# EAGLE design msp432_breakout_i2c (EAGLE 7.5.0)
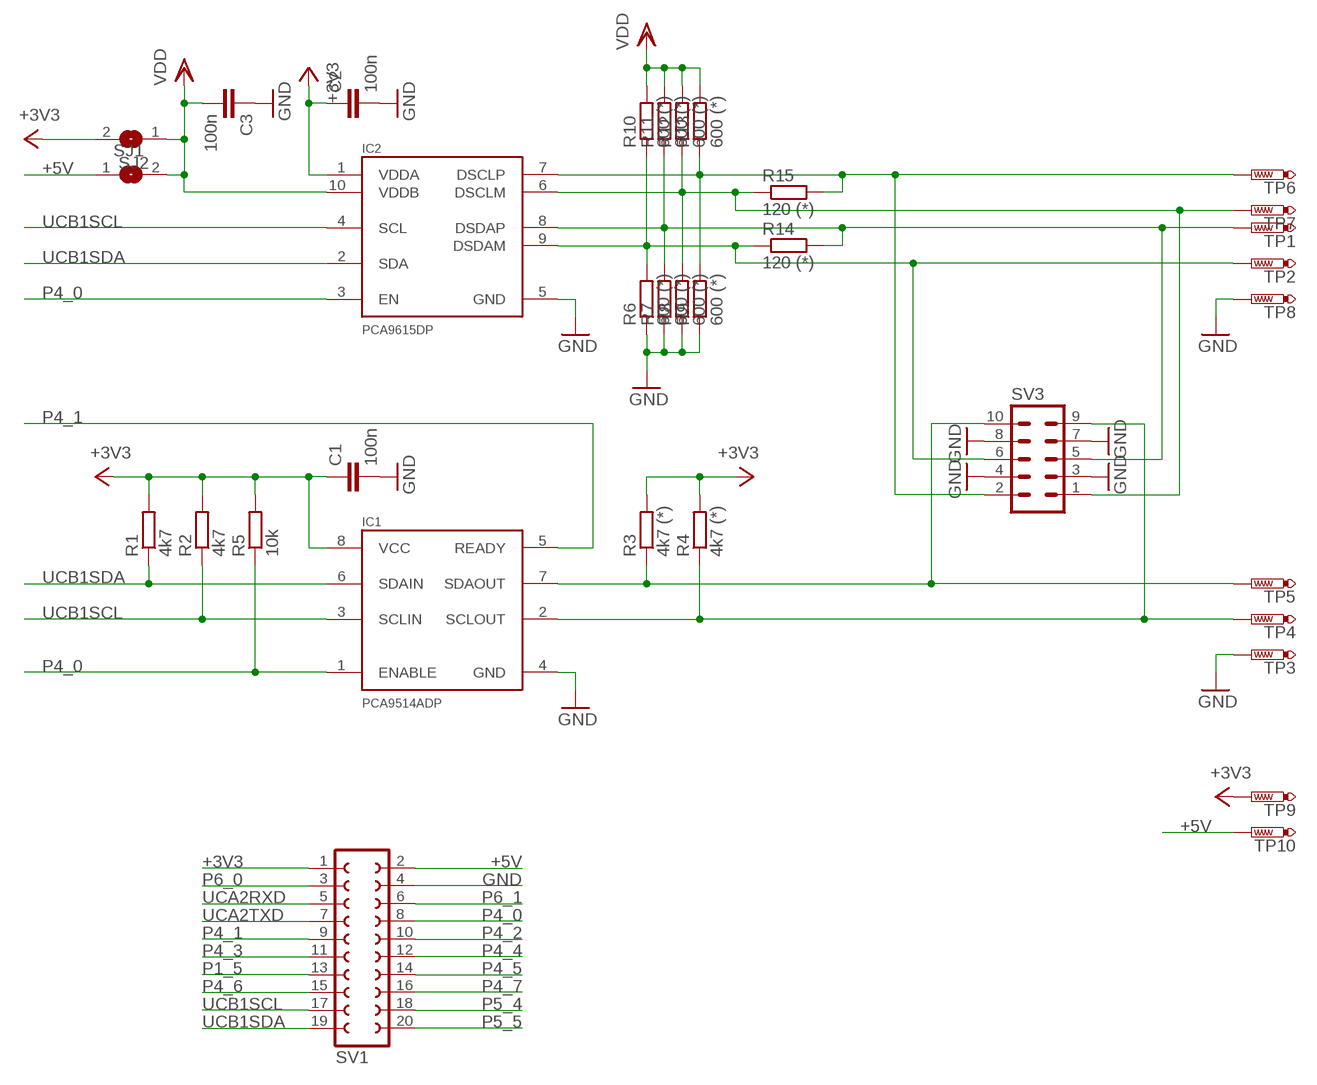
[diagram p0: schematic, sheet 1]

## Parts
C1  100n  C-EUC0603  [C0603]
C2  100n  C-EUC0603  [C0603]
C3  100n  C-EUC0603  [C0603]
IC1  PCA9514ADP  [TSSOP8]
IC2  PCA9615DP  [TSSOP10]
R1  4k7  R-EU_R0603  [R0603]
R2  4k7  R-EU_R0603  [R0603]
R3  4k7 (*)  R-EU_R0603  [R0603]
R4  4k7 (*)  R-EU_R0603  [R0603]
R5  10k  R-EU_R0603  [R0603]
R6  600 (*)  R-EU_R0603  [R0603]
R7  600 (*)  R-EU_R0603  [R0603]
R8  600 (*)  R-EU_R0603  [R0603]
R9  600 (*)  R-EU_R0603  [R0603]
R10  600 (*)  R-EU_R0603  [R0603]
R11  600 (*)  R-EU_R0603  [R0603]
R12  600 (*)  R-EU_R0603  [R0603]
R13  600 (*)  R-EU_R0603  [R0603]
R14  120 (*)  R-EU_R0603  [R0603]
R15  120 (*)  R-EU_R0603  [R0603]
SJ1  SJ  [SJ]
SJ2  SJ  [SJ]
SV1  FE10-2  [FE10-2]
SV3  ML10  [ML10]
TP1  DSDAP  PTR1PAD1-17  [P1-17]
TP2  DSDAM  PTR1PAD1-17  [P1-17]
TP3  GND  PTR1PAD1-17  [P1-17]
TP4  SCLOUT  PTR1PAD1-17  [P1-17]
TP5  SDAOUT  PTR1PAD1-17  [P1-17]
TP6  DSCLP  PTR1PAD1-17  [P1-17]
TP7  DSCLM  PTR1PAD1-17  [P1-17]
TP8  GND  PTR1PAD1-17  [P1-17]
TP9  3V3  PTR1PAD1-17  [P1-17]
TP10  5V  PTR1PAD1-17  [P1-17]

## Nets
+3V3: C1.1 C2.1 IC1.8(VCC) IC2.1(VDDA) R1.2 R2.2 R3.2 R4.2 R5.2 SJ2.2 SV1.1 TP9.TP
+5V: SJ1.1 SV1.2 TP10.TP
GND [power]: C1.2 C2.2 C3.1 IC1.4(GND) IC2.5(GND) R6.1 R7.1 R8.1 R9.1 SV1.4 SV3.3 SV3.4 SV3.7 SV3.8 TP3.TP TP8.TP
P1_5: SV1.13
P4_0: IC1.1(ENABLE) IC2.3(EN) R5.1 SV1.8
P4_1: IC1.5(READY) SV1.9
P4_2: SV1.10
P4_3: SV1.11
P4_4: SV1.12
P4_5: SV1.14
P4_6: SV1.15
P4_7: SV1.16
P5_4: SV1.18
P5_5: SV1.20
P6_0: SV1.3
P6_1: SV1.6
SCL: IC1.2(SCLOUT) R4.1 SV3.9 TP4.TP
SCLM: IC2.6(DSCLM) R8.2 R12.1 R15.1 SV3.1 TP7.TP
SCLP: IC2.7(DSCLP) R9.2 R13.1 R15.2 SV3.2 TP6.TP
SDA: IC1.7(SDAOUT) R3.1 SV3.10 TP5.TP
SDAM: IC2.9(DSDAM) R6.2 R10.1 R14.1 SV3.6 TP2.TP
SDAP: IC2.8(DSDAP) R7.2 R11.1 R14.2 SV3.5 TP1.TP
UCA2RXD: SV1.5
UCA2TXD: SV1.7
UCB1SCL: IC1.3(SCLIN) IC2.4(SCL) R2.1 SV1.17
UCB1SDA: IC1.6(SDAIN) IC2.2(SDA) R1.1 SV1.19
VDD: C3.2 IC2.10(VDDB) R10.2 R11.2 R12.2 R13.2 SJ1.2 SJ2.1

## Library data of the parts
C1-C3 = rcl:C-EU: CAPACITOR, European symbol
IC1 = sf-bluegiga:PCA9514A
IC2 = sf-bluegiga:PCA9615
R1-R15 = rcl:R-EU_: RESISTOR, European symbol
SJ1 SJ2 = jumper:SJ: SMD solder JUMPER
SV1 = con-lsta:FE10-2: FEMALE HEADER; OC_FARNELL: unknown; OC_NEWARK: unknown
SV3 = con-harting-ml:ML10: HARTING; OC_FARNELL: unknown; OC_NEWARK: unknown
TP1-TP10 = testpad:PTR1: TEST PIN

## Net classes
1 power: width 0.254 mm, drill 0.33 mm, clearance 0.152 mm

## Board
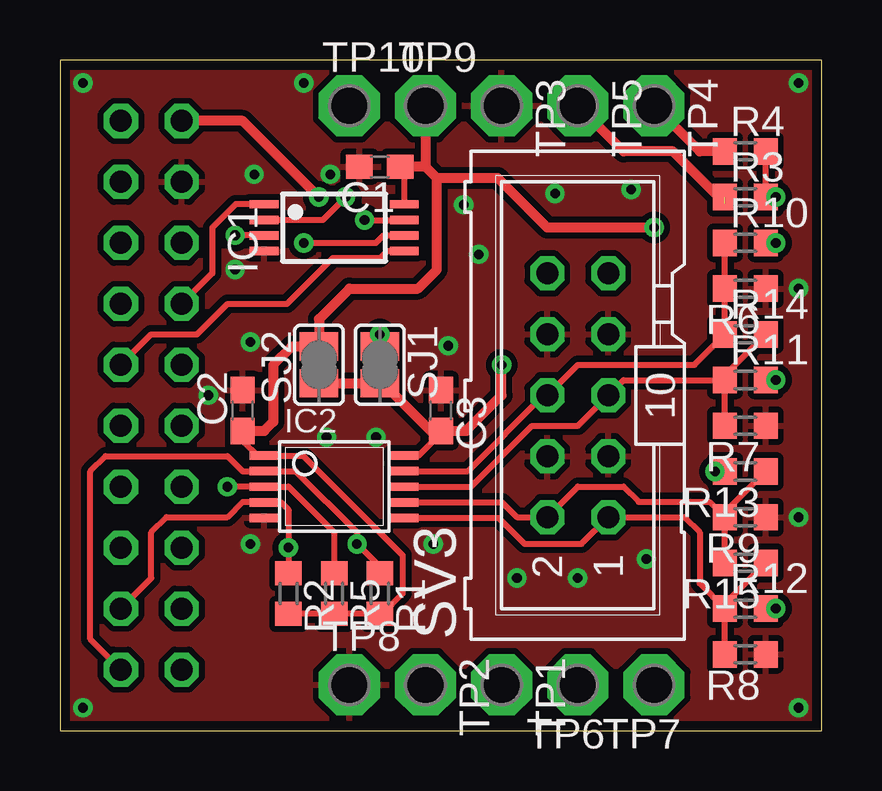
[diagram p1: board, top side]
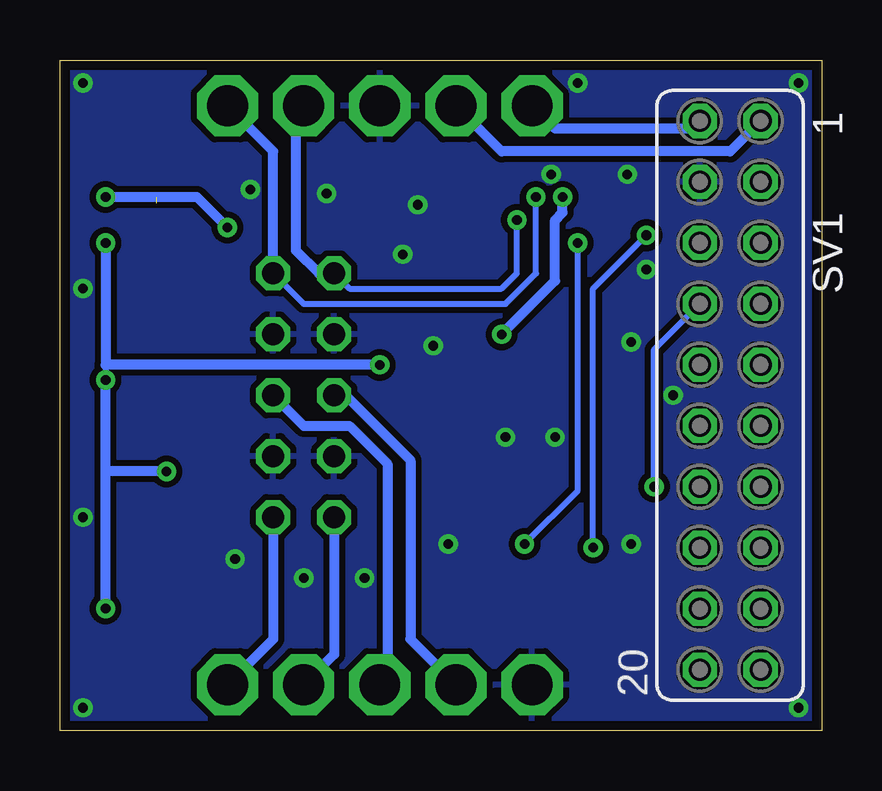
[diagram p2: board, bottom side, seen from below]

Size 31.75 x 27.94 mm. Coordinates in mm from the lower left corner, seen from the top.
Outline: 0,27.94 0,0 31.75,0 31.75,27.94 0,27.94
Copper layers (1*16): Top 0.035mm / dielectric 1.5mm / Bottom 0.035mm
Design rules "default *": minimum track width 10mil, minimum drill 0.4mm, track to track 8mil, track to pad 8mil, pad to pad 8mil, via to via 8mil, smd to smd 0mil, copper to edge 16mil, drill to drill 8mil, minimum pad ring 10mil, minimum via ring 8mil, stop-mask expansion 4mil, vias tented up to drill 0.4mm, thermal gap 10mil

### Footprints (pad centres in the part's own frame; a part is rotated, then mirrored left to right if it is on the bottom)
C0603 = smd 1.1 x 1: 1 -0.85,0; 2 0.85,0
TSSOP8 = smd 1.2 x 0.35: 1 -2.925,0.975; 2 -2.925,0.325; 3 -2.925,-0.325; 4 -2.925,-0.975; 5 2.925,-0.975; 6 2.925,-0.325; 7 2.925,0.325; 8 2.925,0.975
TSSOP10 = smd 0.35 x 1.2: 1 -1.3,-2.918; 2 -0.65,-2.918; 3 0,-2.918; 4 0.65,-2.918; 5 1.3,-2.918; 6 1.3,2.918; 7 0.65,2.918; 8 0,2.918; 9 -0.65,2.918; 10 -1.3,2.918
R0603 = smd 1 x 1.1: 1 -0.85,0; 2 0.85,0
SJ = smd 1.168 x 1.6: 1 -0.762,0; 2 0.762,0
FE10-2 = drill 0.914 octagon: 1 -11.43,1.27; 2 -11.43,-1.27; 3 -8.89,1.27; 4 -8.89,-1.27; 5 -6.35,1.27; 6 -6.35,-1.27; 7 -3.81,1.27; 8 -3.81,-1.27; 9 -1.27,1.27; 10 -1.27,-1.27; 11 1.27,1.27; 12 1.27,-1.27; 13 3.81,1.27; 14 3.81,-1.27; 15 6.35,1.27; 16 6.35,-1.27; 17 8.89,1.27; 18 8.89,-1.27; 19 11.43,1.27; 20 11.43,-1.27
ML10 = drill 0.914 octagon: 1 -5.08,-1.27; 2 -5.08,1.27; 3 -2.54,-1.27; 4 -2.54,1.27; 5 0,-1.27; 6 0,1.27; 7 2.54,-1.27; 8 2.54,1.27; 9 5.08,-1.27; 10 5.08,1.27
P1-17 = drill 1.702 pad 2.54 octagon: TP 0,0

### Placement (x,y rotation side)
C1  13.34,23.5 180 top
C2  7.62,13.34 90 top
C3  15.88,13.34 270 top
IC1  11.43,20.95 0 top
IC2  11.43,10.16 270 top
R1  13.34,5.71 270 top
R2  9.53,5.71 270 top
R3  28.57,22.23 0 top
R4  28.57,24.13 0 top
R5  11.43,5.71 270 top
R6  28.57,18.41 180 top
R7  28.57,12.7 180 top
R8  28.57,3.17 180 top
R9  28.57,8.89 180 top
R10  28.57,20.32 0 top
R11  28.57,14.61 0 top
R12  28.57,5.08 0 top
R13  28.57,10.79 180 top
R14  28.57,16.51 0 top
R15  28.57,6.99 180 top
SJ1  13.34,15.24 270 top
SJ2  10.79,15.24 90 top
SV1  3.81,13.97 270 bottom
SV3  21.59,13.97 90 top
TP1  18.41,1.91 270 top
TP2  15.24,1.91 270 top
TP3  18.41,26.04 270 top
TP4  24.77,26.04 270 top
TP5  21.59,26.04 270 top
TP6  21.59,1.91 180 top
TP7  24.77,1.91 180 top
TP8  12.06,1.91 0 top
TP9  15.24,26.04 0 top
TP10  12.06,26.04 0 top

### Tracks (layer width: path | path; a pad name or v marks a point on that pad's centre or on a via)
+3V3  (via drill 0.4)
  Top 0.254: R3.2 R4.2 | 8.29,11.46 8.26,11.43 | R2.2 R5.2 R1.2 13.44,4.87 14.29,5.71 14.29,7.3 10.13,11.46 IC2.1 8.48,11.43 8.26,11.43 | C2.1 7.62,12.06 8.26,11.43 | IC1.8 14.36,23.32 C1.1
  Top 0.406: v29.84,22.23 R3.2 | C2.1 8.52,12.48 8.89,12.86 8.89,15.24 9.65,16 SJ2.2 10.79,17.14 12.06,18.41 14.92,18.41 15.72,19.21 15.72,23.02 | TP9.TP 15.24,23.5 | v24.77,20.95 20.32,20.95 18.26,23.02 15.72,23.02 | 15.72,23.02 15.24,23.5 | 15.24,23.5 C1.1
  Bottom 0.406: SV1.1 3.81,24.13 13.34,24.13 TP9.TP | v24.77,20.95 26.04,22.23 v29.84,22.23
+5V  (via drill 0.4)
  Top 0.406: SJ1.1 v13.34,16.51 | v10.79,22.23 7.62,25.4 SV1.2
  Bottom 0.406: SV1.2 5.4,25.08 11.11,25.08 TP10.TP | v13.34,16.51 11.11,18.73 11.11,21.27 10.79,21.59 v10.79,22.23
GND  (via drill 0.4)
  other vias: 0.95,26.99 30.8,26.99 30.8,0.95 0.95,0.95 7.94,16.19 7.3,19.21 7.94,7.78 15.56,7.78 24.45,7.14 17.46,19.84 11.11,12.22 13.18,12.22 16.83,21.91 21.59,6.35 19.05,6.35 30.8,18.41 30.8,8.89 16.19,16.03 23.81,22.54 10.16,26.99 6.19,13.97 20.64,22.38 11.27,23.18 8.1,23.18
  pour Top (isolate 0.254): 0,27.94 31.75,27.94 31.75,0 0,0
  pour Bottom (isolate 0.254): 0,27.94 31.75,27.94 31.75,0 0,0
N$2
  Top 0.254: 10.79,15.88 10.79,14.61
P4_0  (via drill 0.4)
  Top 0.254: R5.1 11.43,8.26 9.53,10.16 IC2.3 v6.99,10.16 | IC1.1 7.33,21.93 6.35,20.95 6.35,19.05 SV1.8
  Bottom 0.254: v6.99,10.16 6.99,15.88 SV1.8
P4_1
  Top 0.254: SV1.9 3.81,16.51 5.71,16.51 6.99,17.78 9.46,17.78 11.37,19.68 13.34,19.68 13.63,19.98 IC1.5
SCL  (via drill 0.4)
  Top 0.254: IC1.2 10.96,21.28 v11.91,22.23
  Top 0.406: R4.1 26.67,24.13 TP4.TP
  Bottom 0.254: SV3.9 21.59,17.78 13.18,17.78 11.91,19.05 v11.91,22.23
  Bottom 0.406: SV3.9 22.86,24.13 TP4.TP
SCLM
  Top 0.254: R8.2 R12.1 | R12.1 27.73,5.29 R15.1 | R12.1 26.67,6.13 26.67,8.26 26.04,8.89 SV3.1 21.75,7.78 19.37,7.78 18.29,8.86 IC2.6
  Bottom 0.406: SV3.1 22.86,3.81 TP7.TP
SCLP
  Top 0.254: R15.2 R9.2 | R9.2 27.73,9.1 R13.1 | R9.2 27.09,9.53 24.13,9.53 23.5,10.16 21.59,10.16 SV3.2 19.05,8.89 18.43,9.51 IC2.7
  Bottom 0.406: SV3.2 20.32,3.17 TP6.TP
SDA  (via drill 0.4)  (1 unrouted)
  Top 0.254: v12.7,21.27 14.35,21.27 IC1.7
  Top 0.406: TP5.TP 23.5,24.13 25.56,24.13 27.73,21.96
  Bottom 0.254: SV3.10 19.68,18.41 13.34,18.41 12.7,19.05 v12.7,21.27
  Bottom 0.406: SV3.10 20.95,19.05 21.91,20 21.91,25.72 TP5.TP
SDAM
  Top 0.254: R10.1 R6.2 R14.1 26.45,15.24 21.59,15.24 SV3.6 20.16,13.97 17,10.81 IC2.9
  Bottom 0.406: SV3.6 19.84,13.97 17.14,11.27 17.14,3.81 TP2.TP
SDAP
  Top 0.254: R7.2 R11.1 | R11.1 27.73,14.81 R14.2 | R11.1 23.5,14.61 SV3.5 21.59,12.7 19.68,12.7 17.14,10.16 IC2.8
  Bottom 0.406: SV3.5 21.59,12.7 19.68,12.7 18.1,11.11 18.1,2.22 TP1.TP
UCB1SCL  (via drill 0.4)
  Top 0.254: 9.84,6.88 R2.1 v9.53,7.62 9.53,9.21 9.22,9.51 IC2.4 8.5,9.53 7.62,9.53 6.99,8.89 4.45,8.89 3.81,8.26 3.81,6.35 SV1.17 | IC1.3 v7.31,20.63 v7.3,20.64
  Bottom 0.254: v9.53,7.62 9.53,18.41 v7.3,20.64
UCB1SDA  (via drill 0.4)
  Top 0.254: R1.1 13.34,6.83 v12.38,7.78 12.38,8.26 9.83,10.81 IC2.2 8.5,10.79 7.62,10.79 6.99,11.43 1.91,11.43 1.27,10.79 1.27,3.81 SV1.19 | v10.16,20.32 13.18,20.32 13.49,20.64 14.35,20.64 IC1.6
  Bottom 0.254: v12.38,7.78 10.16,10 v10.16,20.32
VDD  (via drill 0.4)
  Top 0.254: R10.2 v29.84,20.32 | v29.84,14.61 R11.2 | R12.2 v29.84,5.08 | R13.2 v27.3,10.79 | IC2.10 14.57,11.46 | 14.57,11.46 14.61,11.43 | 14.57,11.46 14.95,11.46 15.88,12.38 C3.2
  Top 0.406: v18.41,15.24 18.41,13.97 16.93,12.48 C3.2 15.46,12.48 13.46,14.48 SJ1.2 | 13.46,14.61 SJ1.2 | SJ2.1 SJ1.2
  Bottom 0.254: 29.84,15.24 v29.84,14.61
  Bottom 0.406: v29.84,20.32 29.84,15.24 v18.41,15.24 | v29.84,5.08 29.84,10.79 | 29.84,10.79 v29.84,14.61 | v27.3,10.79 29.84,10.79

### Text on the board
potisk: MSP | v1/16 | 432 | D | C | D | C | I2C | b/o | - | + | -